# EAGLE design mistral_rtc_candidate0 (EAGLE 7.7.0)
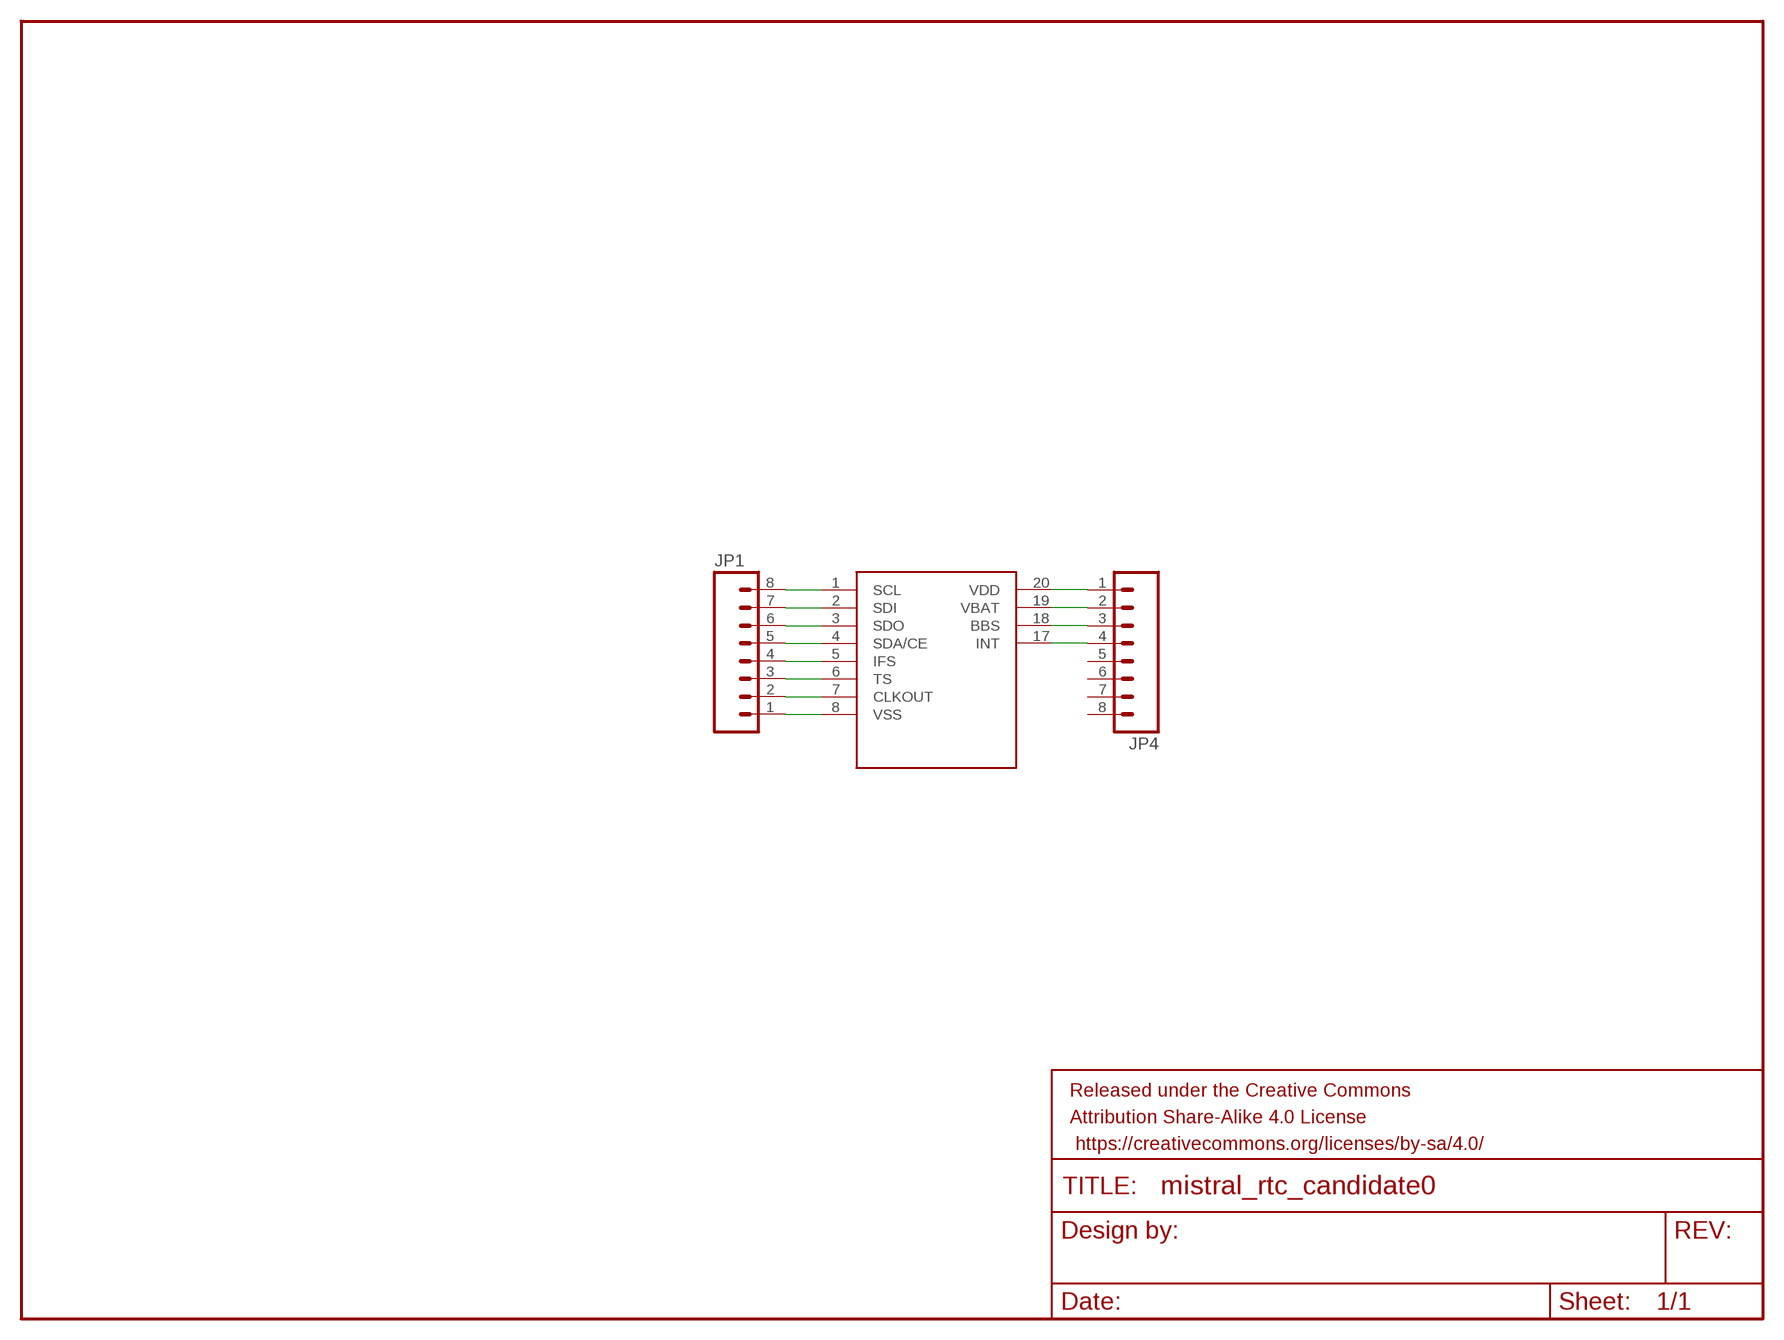
[diagram p0: schematic, sheet 1]

## Parts
FRAME1  FRAME-LETTER  [CREATIVE_COMMONS]
JP1  M08SILK_FEMALE_PTH  [1X08]
JP4  M08SILK_FEMALE_PTH  [1X08]
U$1  PCF2129  [PCF2129]

## Nets
N$15: JP1.1 U$1.8(VSS)
N$16: JP1.2 U$1.7(CLKOUT)
N$17: JP1.3 U$1.6(TS)
N$18: JP1.4 U$1.5(IFS)
N$19: JP1.5 U$1.4(SDA/CE)
N$20: JP1.6 U$1.3(SDO)
N$21: JP1.7 U$1.2(SDI)
N$22: JP1.8 U$1.1(SCL)
N$23: JP4.1 U$1.20(VDD)
N$24: JP4.2 U$1.19(VBAT)
N$25: JP4.3 U$1.18(BBS)
N$26: JP4.4 U$1.17(INT)
Unconnected: JP4.5 JP4.6 JP4.7 JP4.8

## Library data of the parts
FRAME1 = SparkFun-Aesthetics:FRAME-LETTER: Schematic Frame Standard 8.5x11 US Letter frame
JP1 JP4 = SparkFun-Connectors:M08: Header 8 Standard 8-pin 0.1" header. Use with straight break away headers (SKU : PRT-00116), right angle break away headers (PRT-00553), swiss pins (PRT-00743), machine pins (PRT-00117), and female headers (PRT-00115).; PROD_ID: CONN-08438
U$1 = awqua_eagle_library:PCF2129

## Net classes
1 power: width 0.203 mm

## Board
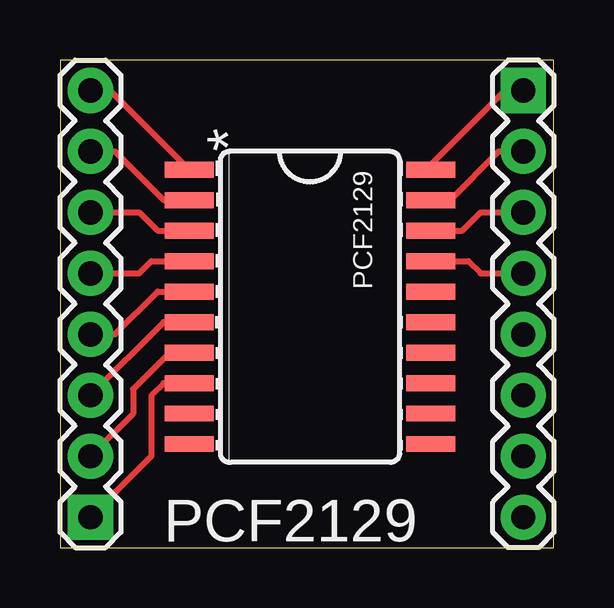
[diagram p1: board, top side]

Size 20.57 x 20.32 mm. Coordinates in mm from the lower left corner, seen from the top.
Outline: 0,0 20.57,0 20.57,20.32 0,20.31 0,0
Copper layers (1*16): Top 0.035mm / dielectric 1.5mm / Bottom 0.035mm
Design rules "default": minimum track width 10mil, minimum drill 24mil, track to track 8mil, track to pad 8mil, pad to pad 8mil, via to via 8mil, smd to smd 8mil, copper to edge 40mil, drill to drill 8mil, minimum pad ring 10mil, minimum via ring 8mil, stop-mask expansion 4mil, vias tented up to drill 0mil, thermal gap 10mil

### Footprints (pad centres in the part's own frame; a part is rotated, then mirrored left to right if it is on the bottom)
1X08 = drill 1.016 pad 1.88 square: 1 0,0 | drill 1.016 pad 1.88: 2 2.54,0; 3 5.08,0; 4 7.62,0; 5 10.16,0; 6 12.7,0; 7 15.24,0; 8 17.78,0
PCF2129 = smd 0.66 x 2.032: 1 -5.588,-5.029; 2 -4.318,-5.029; 3 -3.048,-5.029; 4 -1.778,-5.029; 5 -0.508,-5.029; 6 0.762,-5.029; 7 2.032,-5.029; 8 3.302,-5.029; 9 4.572,-5.029; 10 5.842,-5.029; 11 5.842,5.029; 12 4.572,5.029; 13 3.302,5.029; 14 2.032,5.029; 15 0.762,5.029; 16 -0.508,5.029; 17 -1.778,5.029; 18 -3.048,5.029; 19 -4.318,5.029; 20 -5.588,5.029

### Placement (x,y rotation side)
FRAME1  -18.03,-10.92 0 top  (outside the outline)
JP1  1.27,1.27 90 top
JP4  19.3,19.05 270 top
U$1  10.41,10.16 270 top

### Tracks (layer width: path | path; a pad name or v marks a point on that pad's centre or on a via)
N$15
  Top 0.254: U$1.8 4.32,6.86 3.81,6.35 3.81,3.81 JP1.1
N$16
  Top 0.254: U$1.7 4.57,8.13 3.05,6.6 3.05,5.59 JP1.2
N$17
  Top 0.254: JP1.3 4.32,9.4 U$1.6
N$18
  Top 0.254: JP1.4 2.29,8.89 4.06,10.67 U$1.5
N$19
  Top 0.254: JP1.5 3.3,11.43 3.81,11.94 U$1.4
N$20
  Top 0.254: JP1.6 3.3,13.97 4.06,13.21 U$1.3 5.84,13.21
N$21
  Top 0.254: JP1.7 2.29,16.51 4.32,14.48 U$1.2
N$22
  Top 0.254: JP1.8 2.08,19.05 U$1.1
N$23
  Top 0.254: U$1.20 15.44,15.95 18.54,19.05 JP4.1
N$24
  Top 0.254: U$1.19 16.26,14.48 18.29,16.51 JP4.2
N$25
  Top 0.254: U$1.18 16.76,13.21 17.53,13.97 JP4.3
N$26
  Top 0.254: U$1.17 17.02,11.94 17.53,11.43 JP4.4

### Text on the board
tPlace: * | PCF2129